# Altium project Protótipo_ProjetoBotão.PrjPcb (part 4 of 4)

## Sheet esquematico_prototipo.SchDoc
size A4; SheetNumber: 2; SheetTotal: 2
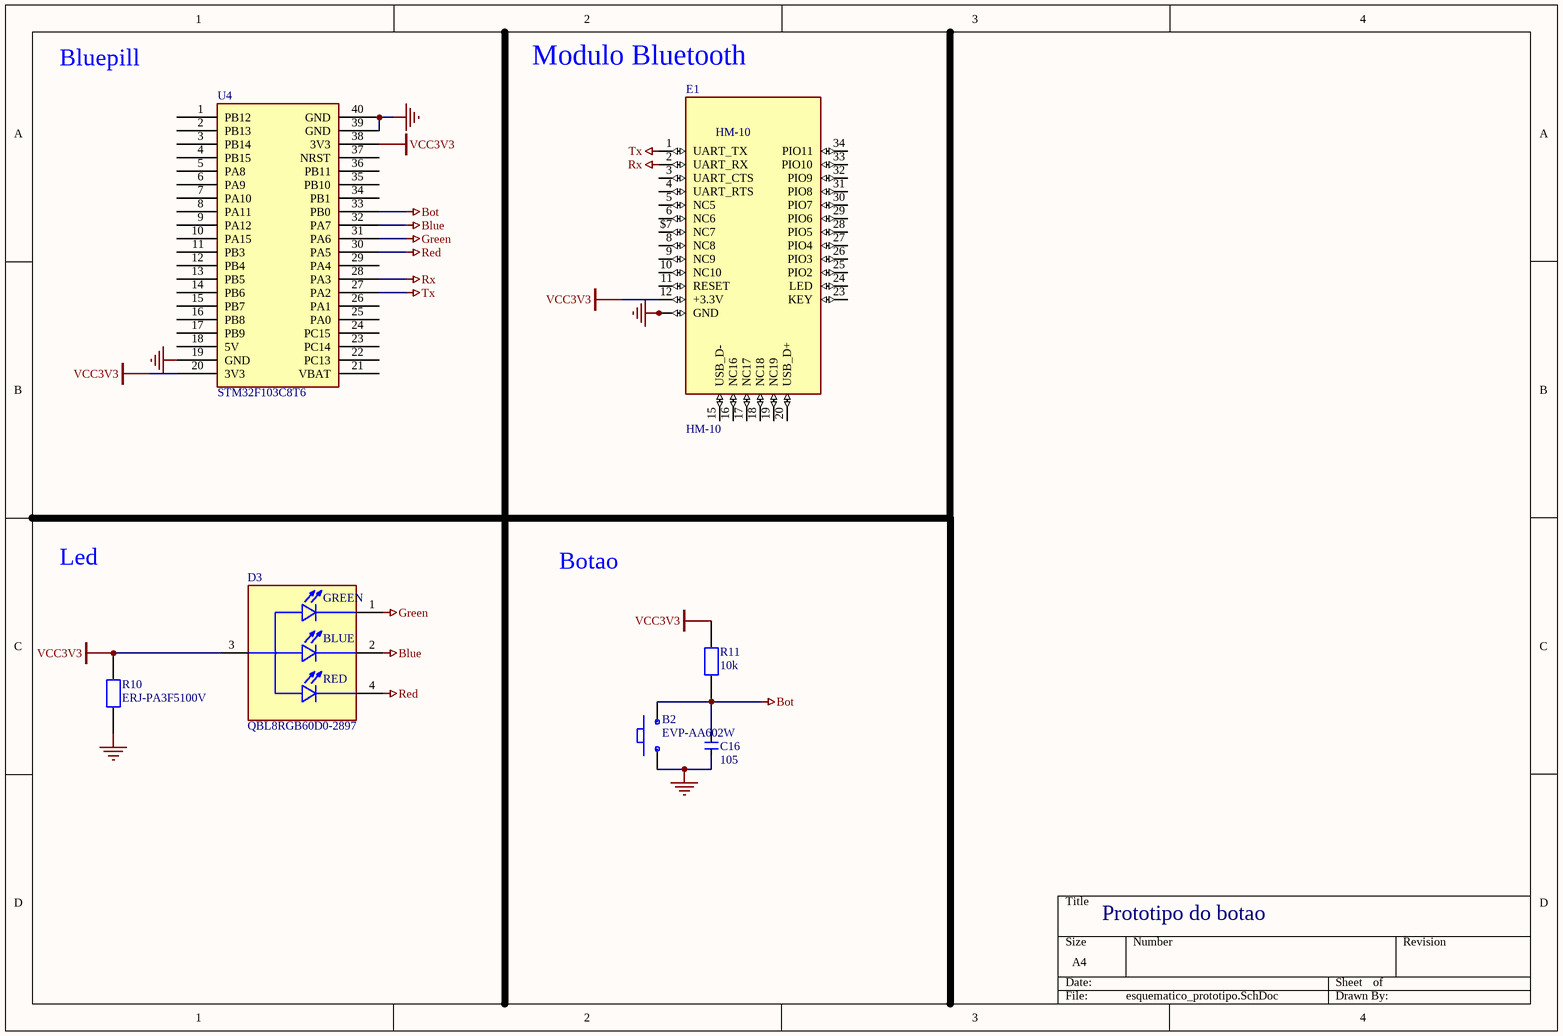
[diagram p1: esquematico_prototipo.SchDoc]

### Parts
B2  EVP-AA602W  [botao]
C16  105  [C_1µF_10V]
D3  QBL8RGB60D0-2897  [LED_QBL8RGB60D0-2897]
E1  HM-10  [26.9X13X2.2_BOARD]
R10  ERJ-PA3F5100V  [R_0603_510]
R11  10k  [R_0603_10K]
U4  STM32F103C8T6  [Stm32 BluePill]

### Nets
Blue: D3.2(CATHODE_BLUE) U4.32(PA7)
Bot: B2.1 C16.1 R11.1 U4.33(PB0)
GND: B2.2 C16.2 E1.13(GND) E1.14(GND) E1.21(GND) E1.22(GND) R10.1 U4.19(GND) U4.39(GND) U4.40(GND)
Green: D3.1(CATHODE_GREEN) U4.31(PA6)
Red: D3.4(CATHODE_RED) U4.30(PA5)
Rx: E1.2(UART_RX) U4.28(PA3)
Tx: E1.1(UART_TX) U4.27(PA2)
VCC3V3: D3.3(COMMON_ANODE) E1.12(+3.3V) R10.2 R11.2 U4.20(3V3) U4.38(3V3)

Not connected (* = marked no-connect by the designer): E1 3(UART_CTS) 4(UART_RTS) 5(NC5) 6(NC6) 8(NC8) 9(NC9) 10(NC10) 11(RESET) 15(USB_D-) 16(NC16) 17(NC17) 18(NC18) 19(NC19) 20(USB_D+) 23(KEY) 24(LED) 25(PIO2) 26(PIO3) 27(PIO4) 28(PIO5) 29(PIO6) 30(PIO7) 31(PIO8) 32(PIO9) 33(PIO10) 34(PIO11) $7(NC7); U4 1(PB12) 2(PB13) 3(PB14) 4(PB15) 5(PA8) 6(PA9) 7(PA10) 8(PA11) 9(PA12) 10(PA15) 11(PB3) 12(PB4) 13(PB5) 14(PB6) 15(PB7) 16(PB8) 17(PB9) 18(5V) 21(VBAT) 22(PC13) 23(PC14) 24(PC15) 25(PA0) 26(PA1) 29(PA4) 34(PB1) 35(PB10) 36(PB11) 37(NRST)

### Notes on the sheet
- Bluepill
- Modulo Bluetooth
- Led
- Botao
- Prototipo do botao
- (in symbol QBL8RGB60D0-2897) GREEN; BLUE; RED

### Library data of the parts
B2 = EVP-AA602W: Switch Tactile N.O. SPST Rectangular Button J-Bend 0.02A 15VDC 3.5N SMD Embossed T/R; Manufacturer: Panasonic; Actuator Length: 300µm; Contact Current Rating: 20mA; Contact Resistance: 100mΩ; Current Rating: 50mA; Electrical Life: 200kcycles; Illumination Type: Illuminated, Non-Illuminated; Max Voltage Rating (DC): 15V; Number of Positions: 1; Switch Function: Off-Mom; Switch Travel: 150µm; Supplier: DigiKey; Supplier Part Number: 10-EVP-AA602WCT-ND; Manufacturer Part Number: EVP-AA602W; RoHS: Compliant; Category: Tactile Switches; Stock: 14605; Pricing: 1=0,83, 10=0,713, 25=0,6632, 100=0,5917, 250=0,54812, 500=0,51772, 1000=0,48978, 2500=0,45678 (USD); Case/Package: SMD/SMT; Color: White; Contact Plating: Gold, Silver; Depth: 2.9mm; Height: 1.4mm; Insulation Resistance: 100MΩ; Lead Free: Lead Free; Length: 4.3mm; Lifecycle Status: Production; Max Current Rating: 20mA; Max Operating Temperature: 85°C; Mechanical Life: 200kcycles; Min Operating Temperature: -40°C; Mounting Technology: Surface Mount; Operating Force: 3.5N; Radiation Hardening: No; REACH SVHC: Yes; Termination: J-Bend; Throw Configuration: SPST; Voltage Rating (DC): 15V; ComponentLink1URL: https://datasheet.octopart.com:443/EVPAA602W-Panasonic-datasheet-156880147.pdf?src-supplier=IHS; ComponentLink1Description: https://datasheet.octopart.com:443/EVPAA602W-Panasonic-datasheet-156880147.pdf?src-supplier=IHS; ComponentLink2URL: https://datasheet.octopart.com:443/EVP-AA602W-Panasonic-datasheet-13050113.pdf?src-supplier=element14+APAC; ComponentLink2Description: https://datasheet.octopart.com:443/EVP-AA602W-Panasonic-datasheet-13050113.pdf?src-supplier=element14+APAC; ComponentLink3URL: https://datasheet.octopart.com:443/EVP-AA602W-Panasonic-datasheet-138897654.pdf?src-supplier=Master+Electronics; ComponentLink3Description: https://datasheet.octopart.com:443/EVP-AA602W-Panasonic-datasheet-138897654.pdf?src-supplier=Master+Electronics; ComponentLink4URL: https://datasheet.octopart.com:443/EVPAA602W-Panasonic-datasheet-130260647.pdf?src-supplier=TME; ComponentLink4Description: https://datasheet.octopart.com:443/EVPAA602W-Panasonic-datasheet-130260647.pdf?src-supplier=TME; ComponentLink5URL: https://datasheet.octopart.com:443/EVP-AA602W-Panasonic-datasheet-94103455.pdf?src-supplier=Future+Electronics; ComponentLink5Description: https://datasheet.octopart.com:443/EVP-AA602W-Panasonic-datasheet-94103455.pdf?src-supplier=Future+Electronics; ComponentLink6URL: https://datasheet.octopart.com:443/EVP-AA602W-Panasonic-datasheet-84052654.pdf?src-supplier=Future+Electronics; ComponentLink6Description: https://datasheet.octopart.com:443/EVP-AA602W-Panasonic-datasheet-84052654.pdf?src-supplier=Future+Electronics; ComponentLink7URL: https://datasheet.octopart.com:443/EVP-AA602W-Panasonic-datasheet-62282203.pdf?src-supplier=Electro+Sonic; ComponentLink7Description: https://datasheet.octopart.com:443/EVP-AA602W-Panasonic-datasheet-62282203.pdf?src-supplier=Electro+Sonic; ComponentLink8URL: https://datasheet.octopart.com:443/EVPAA602W-Panasonic-datasheet-10854221.pdf?src-supplier=Farnell; ComponentLink8Description: https://datasheet.octopart.com:443/EVPAA602W-Panasonic-datasheet-10854221.pdf?src-supplier=Farnell; ComponentLink9URL: https://datasheet.octopart.com:443/EVP-AA602W-Panasonic-datasheet-124616.pdf?src-supplier=DigiKey; ComponentLink9Description: https://datasheet.octopart.com:443/EVP-AA602W-Panasonic-datasheet-124616.pdf?src-supplier=DigiKey
C16 = CL10B105KP8NNNC: 10V 1uF X7R ±10% 0603 Multilayer Ceramic Capacitors MLCC - SMD/SMT ROHS; Manufacturer: Samsung Electro-Mechanics; Value: 1µF; Supplier: DigiKey; Supplier Part Number: 1276-1946-1-ND; Manufacturer Part Number: CL10B105KP8NNNC; RoHS: Compliant; Category: Ceramic Capacitors; Stock: 4586205; Pricing: 1=0,08, 10=0,005 (USD); Case/Package: 0603; Case Code (Imperial): 0603; Case Code (Metric): 1608; China RoHS: Compliant; Contact Plating: Tin; Depth: 800µm; Dielectric: X7R; Dielectric Material: Ceramic; Height: 900µm; Lead Free: Lead Free; Length: 1.6mm; Lifecycle Status: Production; Material: Ceramic; Max Operating Temperature: 125°C; Min Operating Temperature: -55°C; Mounting Technology: Surface Mount; Number of Terminals: 2; Radiation Hardening: No; REACH SVHC: Yes; Schedule B: 8532240020, 8532240020|8532240020, 8532240020|8532240020|8532240020, 8532240020|8532240020|8532240020|8532240020; Thickness: 889µm; Tolerance: 10%; Voltage Rating: 10V; Voltage Rating (DC): 10V; Width: 800µm; ComponentLink1URL: https://datasheet.octopart.com:443/CL10B105KP8NNNC-Samsung-Electro-Mechanics-datasheet-136482318.pdf?src-supplier=IHS; ComponentLink1Description: https://datasheet.octopart.com:443/CL10B105KP8NNNC-Samsung-Electro-Mechanics-datasheet-136482318.pdf?src-supplier=IHS; ComponentLink2URL: https://datasheet.octopart.com:443/CL10B105KP8NNNC-Samsung-Electro-Mechanics-datasheet-116051279.pdf?src-supplier=Future+Electronics; ComponentLink2Description: https://datasheet.octopart.com:443/CL10B105KP8NNNC-Samsung-Electro-Mechanics-datasheet-116051279.pdf?src-supplier=Future+Electronics; ComponentLink3URL: https://datasheet.octopart.com:443/CL10B105KP8NNNC-Samsung-Electro-Mechanics-datasheet-81461854.pdf?src-supplier=Future+Electronics; ComponentLink3Description: https://datasheet.octopart.com:443/CL10B105KP8NNNC-Samsung-Electro-Mechanics-datasheet-81461854.pdf?src-supplier=Future+Electronics; ComponentLink4URL: https://datasheet.octopart.com:443/CL10B105KP8NNNC-Samsung-datasheet-13325309.pdf?src-supplier=Future+Electronics; ComponentLink4Description: https://datasheet.octopart.com:443/CL10B105KP8NNNC-Samsung-datasheet-13325309.pdf?src-supplier=Future+Electronics; ComponentLink5URL: https://datasheet.octopart.com:443/CL10B105KP8NNNC-Samsung-datasheet-26669024.pdf?src-supplier=Future+Electronics; ComponentLink5Description: https://datasheet.octopart.com:443/CL10B105KP8NNNC-Samsung-datasheet-26669024.pdf?src-supplier=Future+Electronics; ComponentLink6URL: https://datasheet.octopart.com:443/CL10B105KP8NNNC-Samsung-Electro-Mechanics-datasheet-149136800.pdf?src-supplier=Future+Electronics; ComponentLink6Description: https://datasheet.octopart.com:443/CL10B105KP8NNNC-Samsung-Electro-Mechanics-datasheet-149136800.pdf?src-supplier=Future+Electronics; ComponentLink7URL: https://datasheet.octopart.com:443/CL10B105KP8NNNC-Samsung-datasheet-37081328.pdf?src-supplier=Future+Electronics; ComponentLink7Description: https://datasheet.octopart.com:443/CL10B105KP8NNNC-Samsung-datasheet-37081328.pdf?src-supplier=Future+Electronics; ComponentLink8URL: https://datasheet.octopart.com/CL10B105KP8NNNC-Samsung-Electro-Mechanics-datasheet-97040617.pdf; ComponentLink8Description: https://datasheet.octopart.com/CL10B105KP8NNNC-Samsung-Electro-Mechanics-datasheet-97040617.pdf; ComponentLink9URL: https://datasheet.octopart.com/CL10B105KP8NNNC-Samsung-Electro-Mechanics-datasheet-8324245.pdf; ComponentLink9Description: https://datasheet.octopart.com/CL10B105KP8NNNC-Samsung-Electro-Mechanics-datasheet-8324245.pdf; ComponentLink10URL: https://datasheet.octopart.com/General-Multilayer-Ceramic-Capacitors-Samsung-datasheet-family-111.pdf; ComponentLink10Description: https://datasheet.octopart.com/General-Multilayer-Ceramic-Capacitors-Samsung-datasheet-family-111.pdf; ComponentLink11URL: https://datasheet.octopart.com:443/CL10B105KP8NNNC-Samsung-Electro-Mechanics-datasheet-11881110.pdf?src-supplier=Arrow+Electronics; ComponentLink11Description: https://datasheet.octopart.com:443/CL10B105KP8NNNC-Samsung-Electro-Mechanics-datasheet-11881110.pdf?src-supplier=Arrow+Electronics; ComponentLink12URL: https://datasheet.octopart.com:443/CL10B105KP8NNNC-Samsung-datasheet-59220082.pdf?src-supplier=TME; ComponentLink12Description: https://datasheet.octopart.com:443/CL10B105KP8NNNC-Samsung-datasheet-59220082.pdf?src-supplier=TME; ComponentLink13URL: http://sigma.octopart.com:80/rohs_certificate/General-Multilayer-Ceramic-Capacitors-Samsung-family-110.pdf?src-supplier=Compliance+Statements; ComponentLink13Description: http://sigma.octopart.com:80/rohs_certificate/General-Multilayer-Ceramic-Capacitors-Samsung-family-110.pdf?src-supplier=Compliance+Statements; ComponentLink14URL: http://sigma.octopart.com:80/rohs_statement/General-Multilayer-Ceramic-Capacitors-Samsung-family-132.pdf?src-supplier=Compliance+Statements; ComponentLink14Description: http://sigma.octopart.com:80/rohs_statement/General-Multilayer-Ceramic-Capacitors-Samsung-family-132.pdf?src-supplier=Compliance+Statements; ComponentLink15URL: http://sigma.octopart.com:80/reach_statement/General-Multilayer-Ceramic-Capacitors-Samsung-family-133.pdf?src-supplier=Compliance+Statements; ComponentLink15Description: http://sigma.octopart.com:80/reach_statement/General-Multilayer-Ceramic-Capacitors-Samsung-family-133.pdf?src-supplier=Compliance+Statements
D3 = QBL8RGB60D0-2897: Red, Green, Blue (RGB) 624nm Red, 525nm Green, 470nm Blue LED Indication - Discrete 2V Red, 3.2V Green, 3.2V Blue Radial; MF: QT Brightek (QTB); SnapEDA_Link: https://www.snapeda.com/parts/QBL8RGB60D0-2897/QT/view-part/?ref=snap; Package: Radial QT Brightek (QTB); Value: *; MP: QBL8RGB60D0-2897; Check_prices: https://www.snapeda.com/parts/QBL8RGB60D0-2897/QT/view-part/?ref=eda
E1 = HM-10: Bluetooth 4.0 module with 4pin base board that can support iphone4s or later.; MF: Jinan Huamao Technology; SnapEDA_Link: https://www.snapeda.com/parts/HM-10/Jinan+Huamao+Technology/view-part/?ref=snap; Package: Package; Value: *; MP: HM-10; Check_prices: https://www.snapeda.com/parts/HM-10/Jinan+Huamao+Technology/view-part/?ref=eda
R10 = ERJ-PA3F5100V: Res Thick Film 0603 510 Ohm 1% 0.25W(1/4W) +/-100ppm/C Molded SMD Automotive Punched T/R; Manufacturer: Panasonic; Max Power Dissipation: 250mW; Value: 510Ω; Temperature Coefficient: 100ppm/°C; Voltage Rating: 150V; Supplier: DigiKey; Supplier Part Number: P510BYCT-ND; Manufacturer Part Number: ERJ-PA3F5100V; RoHS: Compliant; Category: Chip SMD Resistors; Stock: 32893; Pricing: 1=0,14, 10=0,068, 25=0,0532, 50=0,0446, 100=0,0378, 250=0,031, 500=0,02712, 1000=0,02404 (USD); Case/Package: 0603; Case Code (Imperial): 0603; Case Code (Metric): 1608; Composition: Thick Film; Depth: 800µm; Features: Automotive AEC-Q200; Height: 450µm; Length: 1.6002mm; Lifecycle Status: Production; Max Operating Temperature: 155°C; Min Operating Temperature: -55°C; Mounting Technology: Surface Mount; Number of Terminals: 2; Number of Terminations: 2; Packaging: Cut Tape; Power Dissipation: 250mW; Power Rating: 250mW; REACH SVHC: Yes; Schedule B: 8533210045, 8533210045|8533210045|8533210045|8533210045|8533210045; Termination: Solder; Tolerance: 1%; Voltage Rating (DC): 150V; Width: 800µm; Working Voltage: 150V; ComponentLink1URL: https://datasheet.octopart.com:443/ERJ-PA3F5100V-Panasonic-datasheet-68299097.pdf?src-supplier=Future+Electronics; ComponentLink1Description: https://datasheet.octopart.com:443/ERJ-PA3F5100V-Panasonic-datasheet-68299097.pdf?src-supplier=Future+Electronics; ComponentLink2URL: https://datasheet.octopart.com:443/ERJ-PA3F5100V-Panasonic-datasheet-136608609.pdf?src-supplier=Farnell; ComponentLink2Description: https://datasheet.octopart.com:443/ERJ-PA3F5100V-Panasonic-datasheet-136608609.pdf?src-supplier=Farnell; ComponentLink3URL: https://datasheet.octopart.com:443/ERJPA3F5100V-Panasonic-datasheet-21212021.pdf?src-supplier=Farnell; ComponentLink3Description: https://datasheet.octopart.com:443/ERJPA3F5100V-Panasonic-datasheet-21212021.pdf?src-supplier=Farnell; ComponentLink4URL: https://datasheet.octopart.com:443/ERJPA3F5100V-Panasonic-datasheet-16484091.pdf?src-supplier=Farnell; ComponentLink4Description: https://datasheet.octopart.com:443/ERJPA3F5100V-Panasonic-datasheet-16484091.pdf?src-supplier=Farnell; ComponentLink5URL: https://datasheet.octopart.com:443/ERJPA3F5100V-Panasonic-datasheet-5389633.pdf?src-supplier=RS+(Formerly+Allied+Electronics); ComponentLink5Description: https://datasheet.octopart.com:443/ERJPA3F5100V-Panasonic-datasheet-5389633.pdf?src-supplier=RS+(Formerly+Allied+Electronics); ComponentLink6URL: https://datasheet.octopart.com:443/ERJPA3F5100V-Panasonic-datasheet-10838877.pdf?src-supplier=element14+APAC; ComponentLink6Description: https://datasheet.octopart.com:443/ERJPA3F5100V-Panasonic-datasheet-10838877.pdf?src-supplier=element14+APAC; ComponentLink7URL: https://datasheet.octopart.com:443/ERJPA3F5100V-Panasonic-datasheet-10403718.pdf?src-supplier=element14+APAC; ComponentLink7Description: https://datasheet.octopart.com:443/ERJPA3F5100V-Panasonic-datasheet-10403718.pdf?src-supplier=element14+APAC; ComponentLink8URL: https://datasheet.octopart.com:443/ERJPA3F5100V-Panasonic-datasheet-10096723.pdf?src-supplier=element14+APAC; ComponentLink8Description: https://datasheet.octopart.com:443/ERJPA3F5100V-Panasonic-datasheet-10096723.pdf?src-supplier=element14+APAC; ComponentLink9URL: https://datasheet.octopart.com:443/ERJPA3F5100V-Panasonic-datasheet-8399050.pdf?src-supplier=element14+APAC; ComponentLink9Description: https://datasheet.octopart.com:443/ERJPA3F5100V-Panasonic-datasheet-8399050.pdf?src-supplier=element14+APAC; ComponentLink10URL: https://datasheet.octopart.com:443/ERJPA3F5100V-Panasonic-datasheet-13272697.pdf?src-supplier=element14+APAC; ComponentLink10Description: https://datasheet.octopart.com:443/ERJPA3F5100V-Panasonic-datasheet-13272697.pdf?src-supplier=element14+APAC; ComponentLink11URL: https://datasheet.octopart.com:443/ERJPA3F5100V-Panasonic-datasheet-60482970.pdf?src-supplier=element14+APAC; ComponentLink11Description: https://datasheet.octopart.com:443/ERJPA3F5100V-Panasonic-datasheet-60482970.pdf?src-supplier=element14+APAC; ComponentLink12URL: https://datasheet.octopart.com:443/ERJPA3F5100V-Panasonic-datasheet-170667599.pdf?src-supplier=TME; ComponentLink12Description: https://datasheet.octopart.com:443/ERJPA3F5100V-Panasonic-datasheet-170667599.pdf?src-supplier=TME; ComponentLink13URL: https://datasheet.octopart.com:443/ERJPA3F5100V-Panasonic-datasheet-164871483.pdf?src-supplier=Burklin+Elektronik; ComponentLink13Description: https://datasheet.octopart.com:443/ERJPA3F5100V-Panasonic-datasheet-164871483.pdf?src-supplier=Burklin+Elektronik; ComponentLink14URL: https://datasheet.octopart.com:443/ERJ-PA3F5100V-Panasonic-datasheet-62334979.pdf?src-supplier=Newark; ComponentLink14Description: https://datasheet.octopart.com:443/ERJ-PA3F5100V-Panasonic-datasheet-62334979.pdf?src-supplier=Newark
R11 = ERJPA3F1002V: Res Thick Film 0603 10K Ohm 1% 0.25W(1/4W) ±100ppm/C Pad SMD Automotive T/R; Manufacturer: Panasonic; Max Power Dissipation: 250mW; Power Rating: 330mW; Value: 10kΩ; Temperature Coefficient: 100ppm/°C; Voltage Rating: 150V; Supplier: DigiKey; Supplier Part Number: P10KBYCT-ND; Manufacturer Part Number: ERJPA3F1002V; RoHS: Compliant; Category: Chip SMD Resistors; Stock: 53972; Pricing: 1=0,14, 10=0,068, 25=0,0532, 50=0,0446, 100=0,0377, 250=0,03096, 500=0,0271, 1000=0,02402 (USD); Case/Package: 0603; Case Code (Imperial): 0603; Case Code (Metric): 1608; Composition: Thick Film; Depth: 800µm; Features: Automotive AEC-Q200; Height: 450µm; Length: 1.6002mm; Lifecycle Status: Production; Max Operating Temperature: 155°C; Min Operating Temperature: -55°C; Mounting Technology: Surface Mount; Number of Terminals: 2; Number of Terminations: 2; Packaging: Cut Tape; Power Dissipation: 250mW; REACH SVHC: Yes; Schedule B: 8533210045, 8533210045|8533210045|8533210045|8533210045|8533210045; Termination: Solder; Tolerance: 1%; Voltage Rating (DC): 150V; Width: 800µm; Working Voltage: 150V; ComponentLink1URL: https://datasheet.octopart.com:443/ERJPA3F1002V-Panasonic-datasheet-182147306.pdf?src-supplier=IHS; ComponentLink1Description: https://datasheet.octopart.com:443/ERJPA3F1002V-Panasonic-datasheet-182147306.pdf?src-supplier=IHS; ComponentLink2URL: https://datasheet.octopart.com:443/ERJPA3F1002V-Panasonic-datasheet-68299097.pdf?src-supplier=ODG+(Origin+Data+Global); ComponentLink2Description: https://datasheet.octopart.com:443/ERJPA3F1002V-Panasonic-datasheet-68299097.pdf?src-supplier=ODG+(Origin+Data+Global); ComponentLink3URL: https://datasheet.octopart.com:443/ERJPA3F1002V-Panasonic-datasheet-136608609.pdf?src-supplier=Newark; ComponentLink3Description: https://datasheet.octopart.com:443/ERJPA3F1002V-Panasonic-datasheet-136608609.pdf?src-supplier=Newark; ComponentLink4URL: https://datasheet.octopart.com:443/ERJ-PA3F1002V-Panasonic-datasheet-62334979.pdf?src-supplier=Newark; ComponentLink4Description: https://datasheet.octopart.com:443/ERJ-PA3F1002V-Panasonic-datasheet-62334979.pdf?src-supplier=Newark; ComponentLink5URL: https://datasheet.octopart.com:443/ERJPA3F1002V-Panasonic-datasheet-5389633.pdf?src-supplier=RS+(Formerly+Allied+Electronics); ComponentLink5Description: https://datasheet.octopart.com:443/ERJPA3F1002V-Panasonic-datasheet-5389633.pdf?src-supplier=RS+(Formerly+Allied+Electronics); ComponentLink6URL: https://datasheet.octopart.com:443/ERJ-PA3F1002V-Panasonic-datasheet-142522929.pdf?src-supplier=Master+Electronics; ComponentLink6Description: https://datasheet.octopart.com:443/ERJ-PA3F1002V-Panasonic-datasheet-142522929.pdf?src-supplier=Master+Electronics; ComponentLink7URL: https://datasheet.octopart.com:443/ERJPA3F1002V-Panasonic-datasheet-10838877.pdf?src-supplier=element14+APAC; ComponentLink7Description: https://datasheet.octopart.com:443/ERJPA3F1002V-Panasonic-datasheet-10838877.pdf?src-supplier=element14+APAC; ComponentLink8URL: https://datasheet.octopart.com:443/ERJPA3F1002V-Panasonic-datasheet-10403718.pdf?src-supplier=element14+APAC; ComponentLink8Description: https://datasheet.octopart.com:443/ERJPA3F1002V-Panasonic-datasheet-10403718.pdf?src-supplier=element14+APAC; ComponentLink9URL: https://datasheet.octopart.com:443/ERJPA3F1002V-Panasonic-datasheet-10096723.pdf?src-supplier=element14+APAC; ComponentLink9Description: https://datasheet.octopart.com:443/ERJPA3F1002V-Panasonic-datasheet-10096723.pdf?src-supplier=element14+APAC; ComponentLink10URL: https://datasheet.octopart.com:443/ERJPA3F1002V-Panasonic-datasheet-8399050.pdf?src-supplier=element14+APAC; ComponentLink10Description: https://datasheet.octopart.com:443/ERJPA3F1002V-Panasonic-datasheet-8399050.pdf?src-supplier=element14+APAC; ComponentLink11URL: https://datasheet.octopart.com:443/ERJPA3F1002V-Panasonic-datasheet-13272697.pdf?src-supplier=element14+APAC; ComponentLink11Description: https://datasheet.octopart.com:443/ERJPA3F1002V-Panasonic-datasheet-13272697.pdf?src-supplier=element14+APAC; ComponentLink12URL: https://datasheet.octopart.com:443/ERJPA3F1002V-Panasonic-datasheet-60482970.pdf?src-supplier=element14+APAC; ComponentLink12Description: https://datasheet.octopart.com:443/ERJPA3F1002V-Panasonic-datasheet-60482970.pdf?src-supplier=element14+APAC; ComponentLink13URL: https://datasheet.octopart.com:443/ERJPA3F1002V-Panasonic-datasheet-21212021.pdf?src-supplier=Farnell; ComponentLink13Description: https://datasheet.octopart.com:443/ERJPA3F1002V-Panasonic-datasheet-21212021.pdf?src-supplier=Farnell; ComponentLink14URL: https://datasheet.octopart.com:443/ERJPA3F1002V-Panasonic-datasheet-16484091.pdf?src-supplier=Farnell; ComponentLink14Description: https://datasheet.octopart.com:443/ERJPA3F1002V-Panasonic-datasheet-16484091.pdf?src-supplier=Farnell; ComponentLink15URL: https://datasheet.octopart.com:443/ERJPA3F1002V-Panasonic-datasheet-170667599.pdf?src-supplier=TME; ComponentLink15Description: https://datasheet.octopart.com:443/ERJPA3F1002V-Panasonic-datasheet-170667599.pdf?src-supplier=TME; ComponentLink16URL: https://datasheet.octopart.com:443/ERJPA3F1002V-Panasonic-datasheet-164871483.pdf?src-supplier=Burklin+Elektronik; ComponentLink16Description: https://datasheet.octopart.com:443/ERJPA3F1002V-Panasonic-datasheet-164871483.pdf?src-supplier=Burklin+Elektronik
U4 = BluePill: Designed By @Alixahedi

## Nets that join several sheets
GND: esquematicobluepill (28 pins), esquematico_prototipo (10 pins)
VCC3V3: esquematicobluepill (20 pins), esquematico_prototipo (6 pins)